# EAGLE design schema (EAGLE 6.6.0)
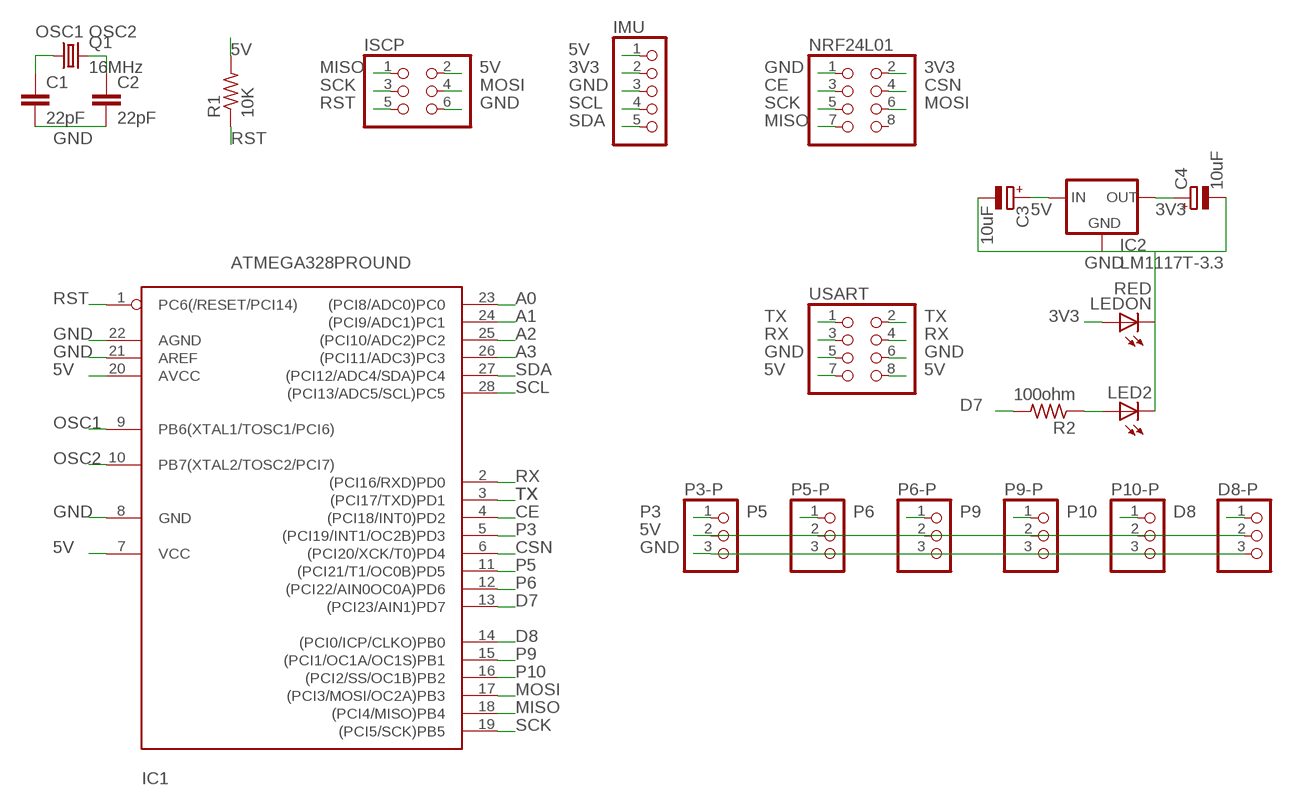
[diagram p0: schematic, sheet 1]

## Parts
C1  22pF  C-EU025-025X050  [C025-025X050]
C2  22pF  C-EU025-025X050  [C025-025X050]
C3  10uF  CPOL-EUTT2D5  [TT2D5]
C4  10uF  CPOL-EUTT2D5  [TT2D5]
D8-P  PINHD-1X3  [1X03]
IC1  ATMEGA328PROUND  [DIL28-3-ROUND]
IC2  LM1117T-3.3  [TO220]
IMU  PINHD-1X5/90  [1X05/90]
ISCP  PINHD-2X3  [2X03]
LED2  LED3MM  [LED3MM]
LEDON  RED  LED3MM  [LED3MM]
NRF24L01  PINHD-2X4/90  [2X04/90]
P3-P  PINHD-1X3  [1X03]
P5-P  PINHD-1X3  [1X03]
P6-P  PINHD-1X3  [1X03]
P9-P  PINHD-1X3  [1X03]
P10-P  PINHD-1X3  [1X03]
Q1  16MHz  CRYSTALHC49U70  [HC49U70]
R1  10K  R-US_0207/12  [0207/12]
R2  100ohm  R-US_0207/12  [0207/12]
USART  PINHD-2X4  [2X04]

## Nets
3V3: C4.+ IC2.2(OUT) IMU.2 LEDON.A NRF24L01.2
5V: C3.+ D8-P.2 IC1.7(VCC) IC1.20(AVCC) IC2.3(IN) IMU.1 ISCP.2 P3-P.2 P5-P.2 P6-P.2 P9-P.2 P10-P.2 R1.2 USART.7 USART.8
A0: IC1.23((PCI8/ADC0)PC0)
A1: IC1.24((PCI9/ADC1)PC1)
A2: IC1.25((PCI10/ADC2)PC2)
A3: IC1.26((PCI11/ADC3)PC3)
CE: IC1.4((PCI18/INT0)PD2) NRF24L01.3
CSN: IC1.6((PCI20/XCK/T0)PD4) NRF24L01.4
D7: IC1.13((PCI23/AIN1)PD7) R2.2
D8: D8-P.1 IC1.14((PCI0/ICP/CLKO)PB0)
GND: C1.2 C2.2 C3.- C4.- D8-P.3 IC1.8(GND) IC1.21(AREF) IC1.22(AGND) IC2.1(GND) IMU.3 ISCP.6 LED2.K(C) LEDON.K(C) NRF24L01.1 P3-P.3 P5-P.3 P6-P.3 P9-P.3 P10-P.3 USART.5 USART.6
MISO: IC1.18((PCI4/MISO)PB4) ISCP.1 NRF24L01.7
MOSI: IC1.17((PCI3/MOSI/OC2A)PB3) ISCP.4 NRF24L01.6
N$2: LED2.A R2.1
OSC1: C1.1 IC1.9(PB6(XTAL1/TOSC1/PCI6)) Q1.1
OSC2: C2.1 IC1.10(PB7(XTAL2/TOSC2/PCI7)) Q1.2
P3: IC1.5((PCI19/INT1/OC2B)PD3) P3-P.1
P5: IC1.11((PCI21/T1/OC0B)PD5) P5-P.1
P6: IC1.12((PCI22/AIN0OC0A)PD6) P6-P.1
P9: IC1.15((PCI1/OC1A/OC1S)PB1) P9-P.1
P10: IC1.16((PCI2/SS/OC1B)PB2) P10-P.1
RST: IC1.1(PC6(/RESET/PCI14)) ISCP.5 R1.1
RX: IC1.2((PCI16/RXD)PD0) USART.3 USART.4
SCK: IC1.19((PCI5/SCK)PB5) ISCP.3 NRF24L01.5
SCL: IC1.28((PCI13/ADC5/SCL)PC5) IMU.4
SDA: IC1.27((PCI12/ADC4/SDA)PC4) IMU.5
TX: IC1.3((PCI17/TXD)PD1) USART.1 USART.2
Unconnected: NRF24L01.8

## Library data of the parts
C1 C2 = resistor:C-EU: CAPACITOR, European symbol
C3 C4 = resistor:CPOL-EU: POLARIZED CAPACITOR, European symbol
D8-P P3-P P5-P P6-P P9-P P10-P = pinhead:PINHD-1X3: PIN HEADER
IC1 = atmega328:ATMEGA328*P: MICROCONTROLLER 32 kBytes FLASH 2 kBytes SRAM 1 kBytes EEPROM USART 8-channel 10 bit ADC
IC2 = lm1117:LM1117T-*
IMU = pinhead:PINHD-1X5: PIN HEADER
ISCP = pinhead:PINHD-2X3: PIN HEADER
LED2 LEDON = led:LED: LED OSRAM: - CHIPLED LG R971, LG N971, LY N971, LG Q971, LY Q971, LO R971, LY R971 LH N974, LH R974 LS Q976, LO Q976, LY Q976 LO Q996 - Hyper CHIPLED LW Q18S LB Q993, LB Q99A, LB R99A - SideLED LS A670, LO A670, LY A670, LG A670, LP A670 LB A673, LV A673, LT A673, LW A673 LH A674 LY A675 LS A676, LA A676, LO A676, LY A676, LW A676 LS A679, LY A679, LG A679 - Hyper Micro SIDELED® LS Y876, LA Y876, LO Y876, LY Y876 LT Y87S - SmartLED LW L88C, LW L88S LB L89C, LB L89S, LG L890 LS L89K, LO L89K, LY L89K LS L896, LA L896, LO L896, LY L896 - TOPLED LS T670, LO T670, LY T670, LG T670, LP T670 LSG T670, LSP T670, LSY T670, LOP T670, LYG T670 LG T671, LOG T671, LSG T671 LB T673, LV T673, LT T673, LW T673 LH T674 LS T676, LA T676, LO T676, LY T676, LB T676, LH T676, LSB T676, LW T676 LB T67C, LV T67C, LT T67C, LS T67K, LO T67K, LY T67K, LW E67C LS E67B, LA E67B, LO E67B, LY E67B, LB E67C, LV E67C, LT E67C LW T67C LS T679, LY T679, LG T679 LS T770, LO T770, LY T770, LG T770, LP T770 LB T773, LV T773, LT T773, LW T773 LH T774 LS E675, LA E675, LY E675, LS T675 LS T776, LA T776, LO T776, LY T776, LB T776 LHGB T686 LT T68C, LB T68C - Hyper Mini TOPLED® LB M676 - Mini TOPLED Santana® LG M470 LS M47K, LO M47K, LY M47K Source: http://www.osram.convergy.de LUXEON: - LUMILED® LXK2-PW12-R00, LXK2-PW12-S00, LXK2-PW14-U00, LXK2-PW14-V00 LXK2-PM12-R00, LXK2-PM12-S00, LXK2-PM14-U00 LXK2-PE12-Q00, LXK2-PE12-R00, LXK2-PE12-S00, LXK2-PE14-T00, LXK2-PE14-U00 LXK2-PB12-K00, LXK2-PB12-L00, LXK2-PB12-M00, LXK2-PB14-N00, LXK2-PB14-P00, LXK2-PB14-Q00 LXK2-PR12-L00, LXK2-PR12-M00, LXK2-PR14-Q00, LXK2-PR14-R00 LXK2-PD12-Q00, LXK2-PD12-R00, LXK2-PD12-S00 LXK2-PH12-R00, LXK2-PH12-S00 LXK2-PL12-P00, LXK2-PL12-Q00, LXK2-PL12-R00 Source: www.luxeon.com KINGBRIGHT: KA-3528ASYC Source: www.kingbright.com
NRF24L01 USART = pinhead:PINHD-2X4: PIN HEADER
Q1 = crystal:CRYSTAL: CRYSTAL; OC_FARNELL: unknown; OC_NEWARK: unknown
R1 R2 = resistor:R-US_: RESISTOR, American symbol

## Net classes
0 default: width 0.61 mm

## Board
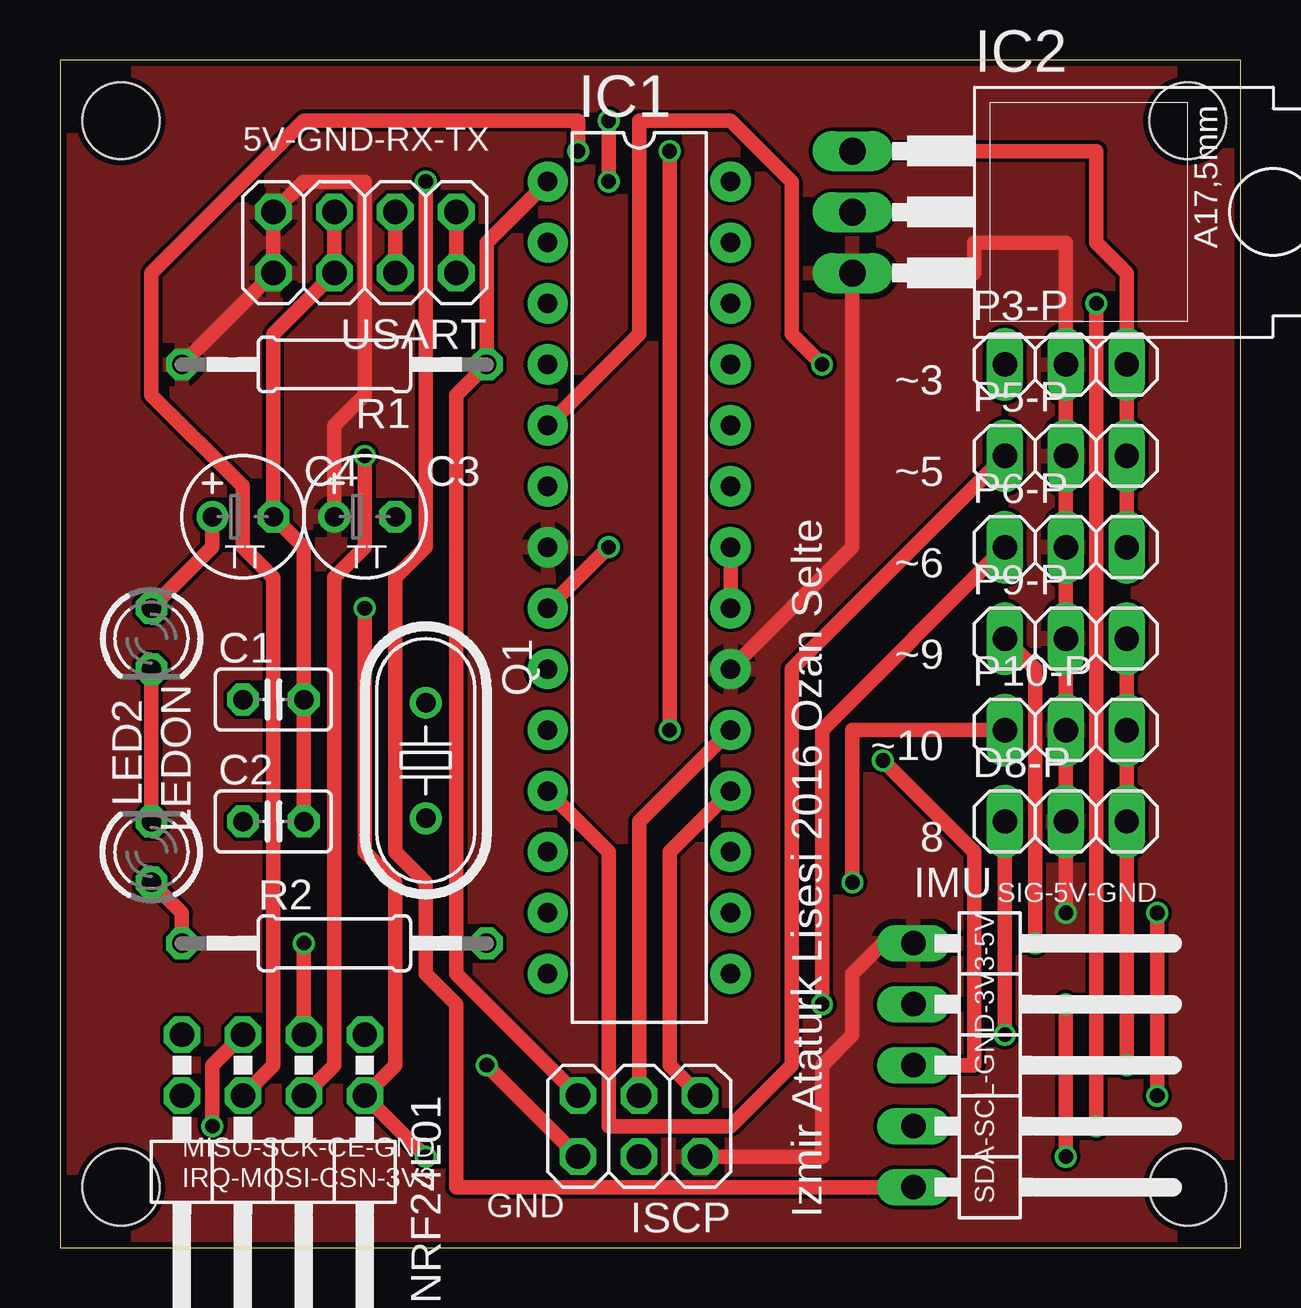
[diagram p1: board, top side]
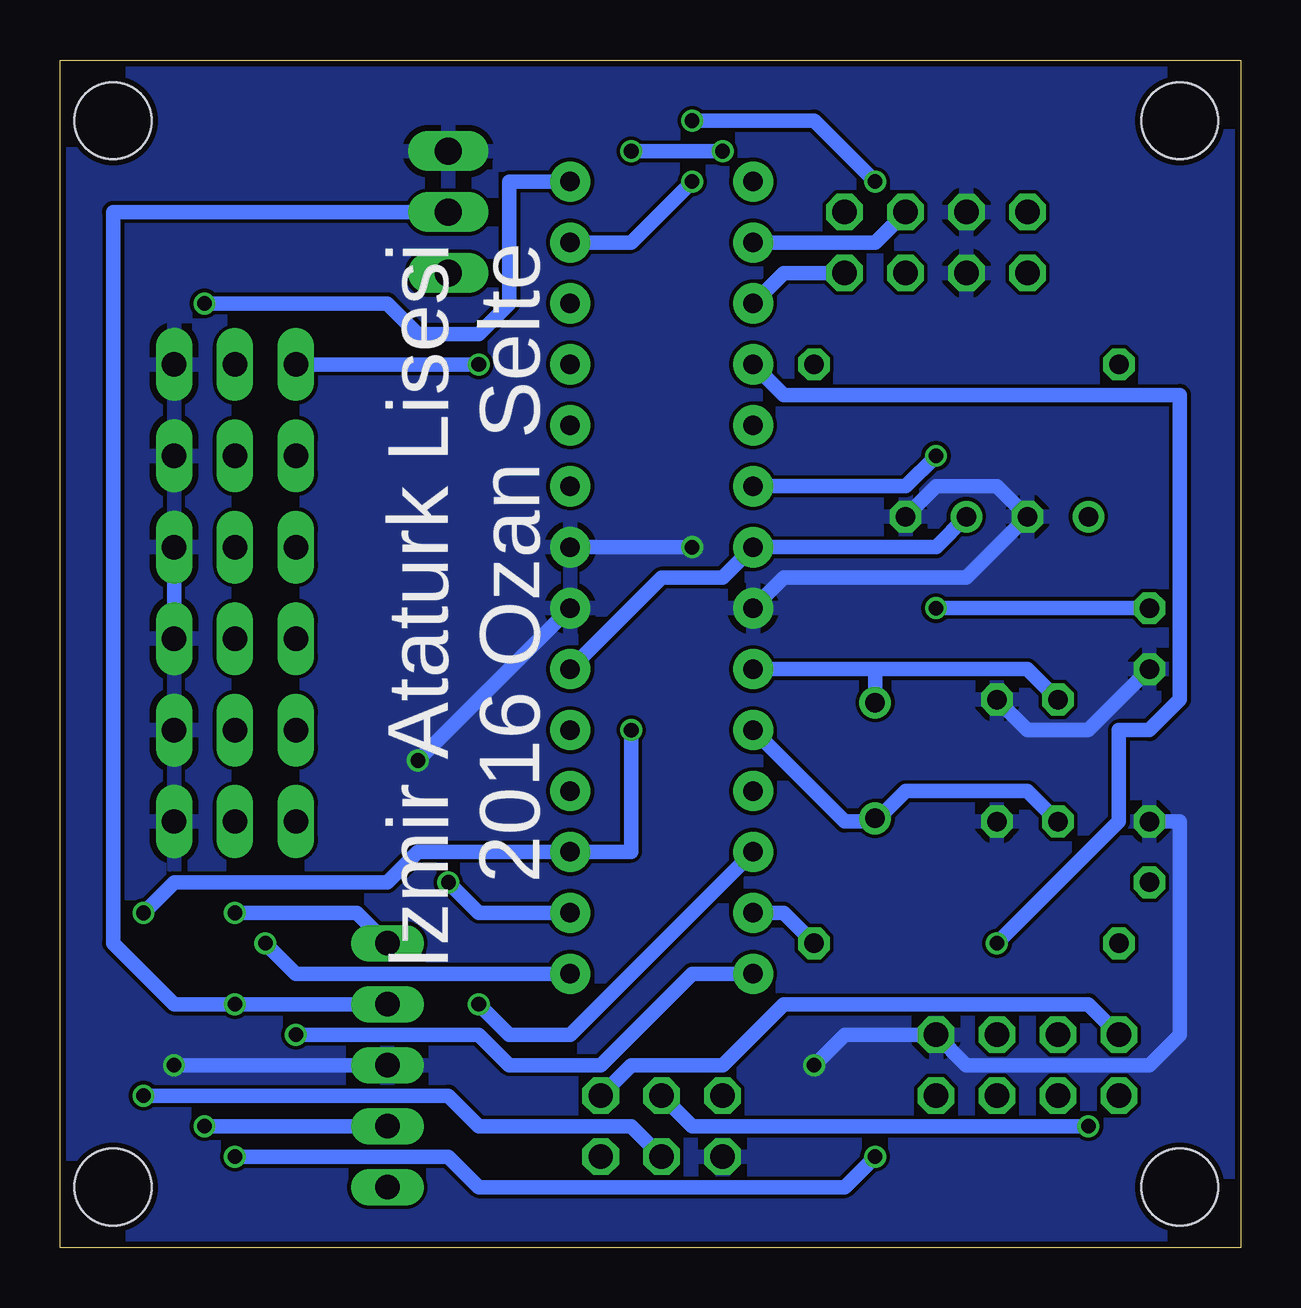
[diagram p2: board, bottom side, seen from below]

Size 49.2 x 49.52 mm. Coordinates in mm from the lower left corner, seen from the top.
Outline: 0,0 49.2,0 49.2,49.52 0,49.52 0,0
Copper layers (1*16): Top 0.035mm / dielectric 1.5mm / Bottom 0.035mm
Design rules "SeeedStudio_2layer_DRU_no_angle_20140221": minimum track width 6mil, minimum drill 12mil, track to track 6mil, track to pad 6mil, pad to pad 6mil, via to via 6mil, smd to smd 0mil, copper to edge 10mil, drill to drill 10mil, minimum pad ring 10mil, minimum via ring 6mil, stop-mask expansion 2mil, vias tented up to drill 100mil, thermal gap 10mil
Holes 3.2 mm at 2.54,46.99 2.54,2.54 46.99,2.54 46.99,46.99

### Footprints (pad centres in the part's own frame; a part is rotated, then mirrored left to right if it is on the bottom)
C025-025X050 = drill 0.813 octagon: 1 -1.27,0; 2 1.27,0
TT2D5 = drill 0.813: + -1.27,0 | drill 0.813 octagon: - 1.27,0
1X03 = drill 1.016 long: 1 -2.54,0; 2 0,0; 3 2.54,0
DIL28-3-ROUND = drill 0.813 pad 1.676: 1 -16.51,-3.81; 2 -13.97,-3.81; 3 -11.43,-3.81; 4 -8.89,-3.81; 5 -6.35,-3.81; 6 -3.81,-3.81; 7 -1.27,-3.81; 8 1.27,-3.81; 9 3.81,-3.81; 10 6.35,-3.81; 11 8.89,-3.81; 12 11.43,-3.81; 13 13.97,-3.81; 14 16.51,-3.81; 15 16.51,3.81; 16 13.97,3.81; 17 11.43,3.81; 18 8.89,3.81; 19 6.35,3.81; 20 3.81,3.81; 21 1.27,3.81; 22 -1.27,3.81; 23 -3.81,3.81; 24 -6.35,3.81; 25 -8.89,3.81; 26 -11.43,3.81; 27 -13.97,3.81; 28 -16.51,3.81
TO220 = drill 1.118 long: 1 -2.54,-6.35; 2 0,-6.35; 3 2.54,-6.35
1X05/90 = drill 1.016 long: 1 -5.08,-3.81; 2 -2.54,-3.81; 3 0,-3.81; 4 2.54,-3.81; 5 5.08,-3.81
2X03 = drill 1.016 octagon: 1 -2.54,-1.27; 2 -2.54,1.27; 3 0,-1.27; 4 0,1.27; 5 2.54,-1.27; 6 2.54,1.27
LED3MM = drill 0.813 octagon: A -1.27,0; K 1.27,0
2X04/90 = drill 1.016 octagon: 1 -3.81,-6.35; 2 -3.81,-3.81; 3 -1.27,-6.35; 4 -1.27,-3.81; 5 1.27,-6.35; 6 1.27,-3.81; 7 3.81,-6.35; 8 3.81,-3.81
HC49U70 = drill 0.813: 1 -2.413,0; 2 2.413,0
0207/12 = drill 0.813 octagon: 1 -6.35,0; 2 6.35,0
2X04 = drill 1.016 octagon: 1 -3.81,-1.27; 2 -3.81,1.27; 3 -1.27,-1.27; 4 -1.27,1.27; 5 1.27,-1.27; 6 1.27,1.27; 7 3.81,-1.27; 8 3.81,1.27

### Placement (x,y rotation side)
C1  8.89,22.86 0 top
C2  8.89,17.78 0 top
C3  12.7,30.48 0 top
C4  7.62,30.48 0 top
D8-P  41.91,17.78 0 top
IC1  24.13,27.94 270 top
IC2  39.37,43.18 270 top
IMU  39.37,7.62 270 top
ISCP  24.13,5.08 180 top
LED2  3.81,16.51 90 top
LEDON  3.81,25.4 270 top
NRF24L01  8.89,2.54 180 top
P3-P  41.91,36.83 0 top
P5-P  41.91,33.02 0 top
P6-P  41.91,29.21 0 top
P9-P  41.91,25.4 0 top
P10-P  41.91,21.59 0 top
Q1  15.24,20.32 270 top
R1  11.43,36.83 180 top
R2  11.43,12.7 0 top
USART  12.7,41.91 180 top

### Tracks (layer width: path | path; a pad name or v marks a point on that pad's centre or on a via)
3V3  (via drill 0.61)
  Top 0.61: LEDON.A 6.35,29.21 C4.+ | v12.7,26.67 12.7,16.51 13.97,15.24 13.97,7.62 NRF24L01.2 v15.24,3.81 | v41.91,10.16 v41.91,3.81
  Bottom 0.61: LEDON.A v12.7,26.67 | IMU.2 v41.91,10.16 44.45,10.16 46.99,12.7 46.99,43.18 IC2.2 | v15.24,3.81 16.51,2.54 31.75,2.54 33.02,3.81 v41.91,3.81
5V  (via drill 0.61)
  Top 0.61: IC1.20 33.02,29.21 IC2.3 38.1,40.64 38.1,41.91 41.91,41.91 P3-P.2 P5-P.2 P6-P.2 P9-P.2 P10-P.2 D8-P.2 v41.91,13.97 | R1.2 USART.8 USART.7 10.16,44.45 12.7,44.45 12.7,35.56 11.43,34.29 C3.+ | ISCP.2 31.75,3.81 31.75,7.62 33.02,8.89 33.02,11.43 34.29,12.7 IMU.1
  Bottom 0.61: C3.+ 12.7,29.21 IC1.7 21.59,27.94 24.13,27.94 IC1.20 | IMU.1 36.83,13.97 v41.91,13.97
  pour Top: 0,49.53 49.53,49.53 49.53,0 0,0
CE  (via drill 0.61)
  Top 0.61: v10.16,12.7 NRF24L01.3
  Bottom 0.61: v10.16,12.7 5.08,17.78 5.08,21.59 3.81,21.59 2.54,22.86 2.54,35.56 19.05,35.56 IC1.4
CSN  (via drill 0.61)
  Top 0.61: NRF24L01.4 11.43,7.62 11.43,27.94 12.7,29.21 v12.7,33.02
  Bottom 0.61: v12.7,33.02 13.97,31.75 IC1.6
D7
  Bottom 0.61: R2.2 19.05,13.97 IC1.13
D8  (via drill 0.61)
  Top 0.61: v39.37,8.89 D8-P.1
  Bottom 0.61: v39.37,8.89 31.75,8.89 30.48,7.62 26.67,7.62 22.86,11.43 IC1.14
GND  (via drill 0.61)
  Top 0.61: P9-P.3 P10-P.3 D8-P.3 v44.45,7.62 | P6-P.3 P5-P.3 P3-P.3 44.45,40.64 43.18,41.91 43.18,45.72 IC2.1 | LEDON.K LED2.K | v17.78,7.62 ISCP.6 | IC1.22 IC1.21 | USART.5 USART.6 8.89,38.1 C4.- 10.16,29.21 C1.2 C2.2 | IC1.8 v22.86,29.21 | IMU.3 38.1,7.62 38.1,16.51 v34.29,20.32
  Bottom 0.61: v44.45,7.62 IMU.3 | P6-P.3 P9-P.3 | LED2.K 2.54,17.78 2.54,8.89 3.81,7.62 11.43,7.62 NRF24L01.1 16.51,8.89 v17.78,7.62 | C3.- 12.7,31.75 10.16,31.75 C4.- 11.43,27.94 19.05,27.94 IC1.8 | v22.86,29.21 IC1.22 | LEDON.K 6.35,21.59 8.89,21.59 C1.2 | IC1.21 v34.29,20.32
  pour Bottom: 0,49.53 49.53,49.53 49.53,0 0,0
MISO
  Top 0.61: IC1.18 25.4,16.51 25.4,7.62 ISCP.1
  Bottom 0.61: NRF24L01.7 6.35,10.16 19.05,10.16 21.59,7.62 25.4,7.62 ISCP.1
MOSI  (via drill 0.61)
  Top 0.61: NRF24L01.6 8.89,7.62 8.89,27.94 7.62,29.21 7.62,31.75 3.81,35.56 3.81,40.64 10.16,46.99 21.59,46.99 v21.59,45.72 | v25.4,21.59 v25.4,45.72 | v45.72,13.97 v45.72,6.35
  Bottom 0.61: v25.4,45.72 v21.59,45.72 | v25.4,21.59 25.4,16.51 IC1.17 34.29,16.51 35.56,15.24 44.45,15.24 v45.72,13.97 | ISCP.4 25.4,5.08 31.75,5.08 33.02,6.35 v45.72,6.35
N$2
  Top 0.61: LED2.A 5.08,13.97 R2.1
OSC1
  Bottom 0.61: C1.1 8.89,24.13 15.24,24.13 | IC1.9 15.24,24.13 | 15.24,24.13 Q1.1
OSC2
  Bottom 0.61: C2.1 8.89,19.05 13.97,19.05 15.24,17.78 | IC1.10 16.51,17.78 15.24,17.78 | 15.24,17.78 Q1.2
P3  (via drill 0.61)
  Top 0.61: v31.75,36.83 30.48,38.1 30.48,44.45 27.94,46.99 24.13,46.99 24.13,38.1 IC1.5
  Bottom 0.61: v31.75,36.83 P3-P.1
P5
  Top 0.61: P5-P.1 30.48,24.13 30.48,7.62 27.94,5.08 22.86,5.08 22.86,16.51 IC1.11
P6  (via drill 0.61)
  Top 0.61: P6-P.1 31.75,21.59 v31.75,10.16
  Bottom 0.61: v31.75,10.16 30.48,8.89 27.94,8.89 IC1.12
P9  (via drill 0.61)
  Top 0.61: P9-P.1 40.64,24.13 v40.64,12.7
  Bottom 0.61: v40.64,12.7 39.37,11.43 IC1.15
P10  (via drill 0.61)
  Top 0.61: P10-P.1 33.02,21.59 v33.02,15.24
  Bottom 0.61: v33.02,15.24 31.75,13.97 IC1.16
RST
  Top 0.61: IC1.1 17.78,41.91 R1.1 16.51,35.56 16.51,11.43 ISCP.5
RX
  Top 0.61: USART.3 USART.4
  Bottom 0.61: IC1.2 15.24,41.91 USART.3
SCK  (via drill 0.61)
  Top 0.61: NRF24L01.5 6.35,7.62 v6.35,5.08 | IC1.19 24.13,17.78 ISCP.3
  Bottom 0.61: v6.35,5.08 22.86,5.08 ISCP.3
SCL  (via drill 0.61)
  Top 0.61: v43.18,39.37 v43.18,5.08
  Bottom 0.61: v43.18,5.08 IMU.4 | v43.18,39.37 35.56,39.37 34.29,38.1 31.75,38.1 30.48,39.37 30.48,44.45 IC1.28
SDA  (via drill 0.61)
  Top 0.61: IMU.5 16.51,2.54 16.51,10.16 15.24,11.43 15.24,15.24 13.97,16.51 13.97,27.94 15.24,29.21 v15.24,44.45 | v22.86,44.45 v22.86,46.99
  Bottom 0.61: v15.24,44.45 17.78,46.99 v22.86,46.99 | v22.86,44.45 25.4,41.91 IC1.27
TX
  Top 0.61: USART.1 USART.2
  Bottom 0.61: IC1.3 19.05,40.64 USART.2

### Text on the board
tPlace: 5V-GND-RX-TX | ~3 | ~5 | ~6 | ~9 | ~10 | 8 | SIG-5V-GND | SDA-SCL-GND-3V3-5V | MISO-SCK-CE-GND | IRQ-MOSI-CSN-3V3 | GND | Izmir Ataturk Lisesi 2016 Ozan Selte
bPlace: Izmir Ataturk Lisesi / 2016 Ozan Selte